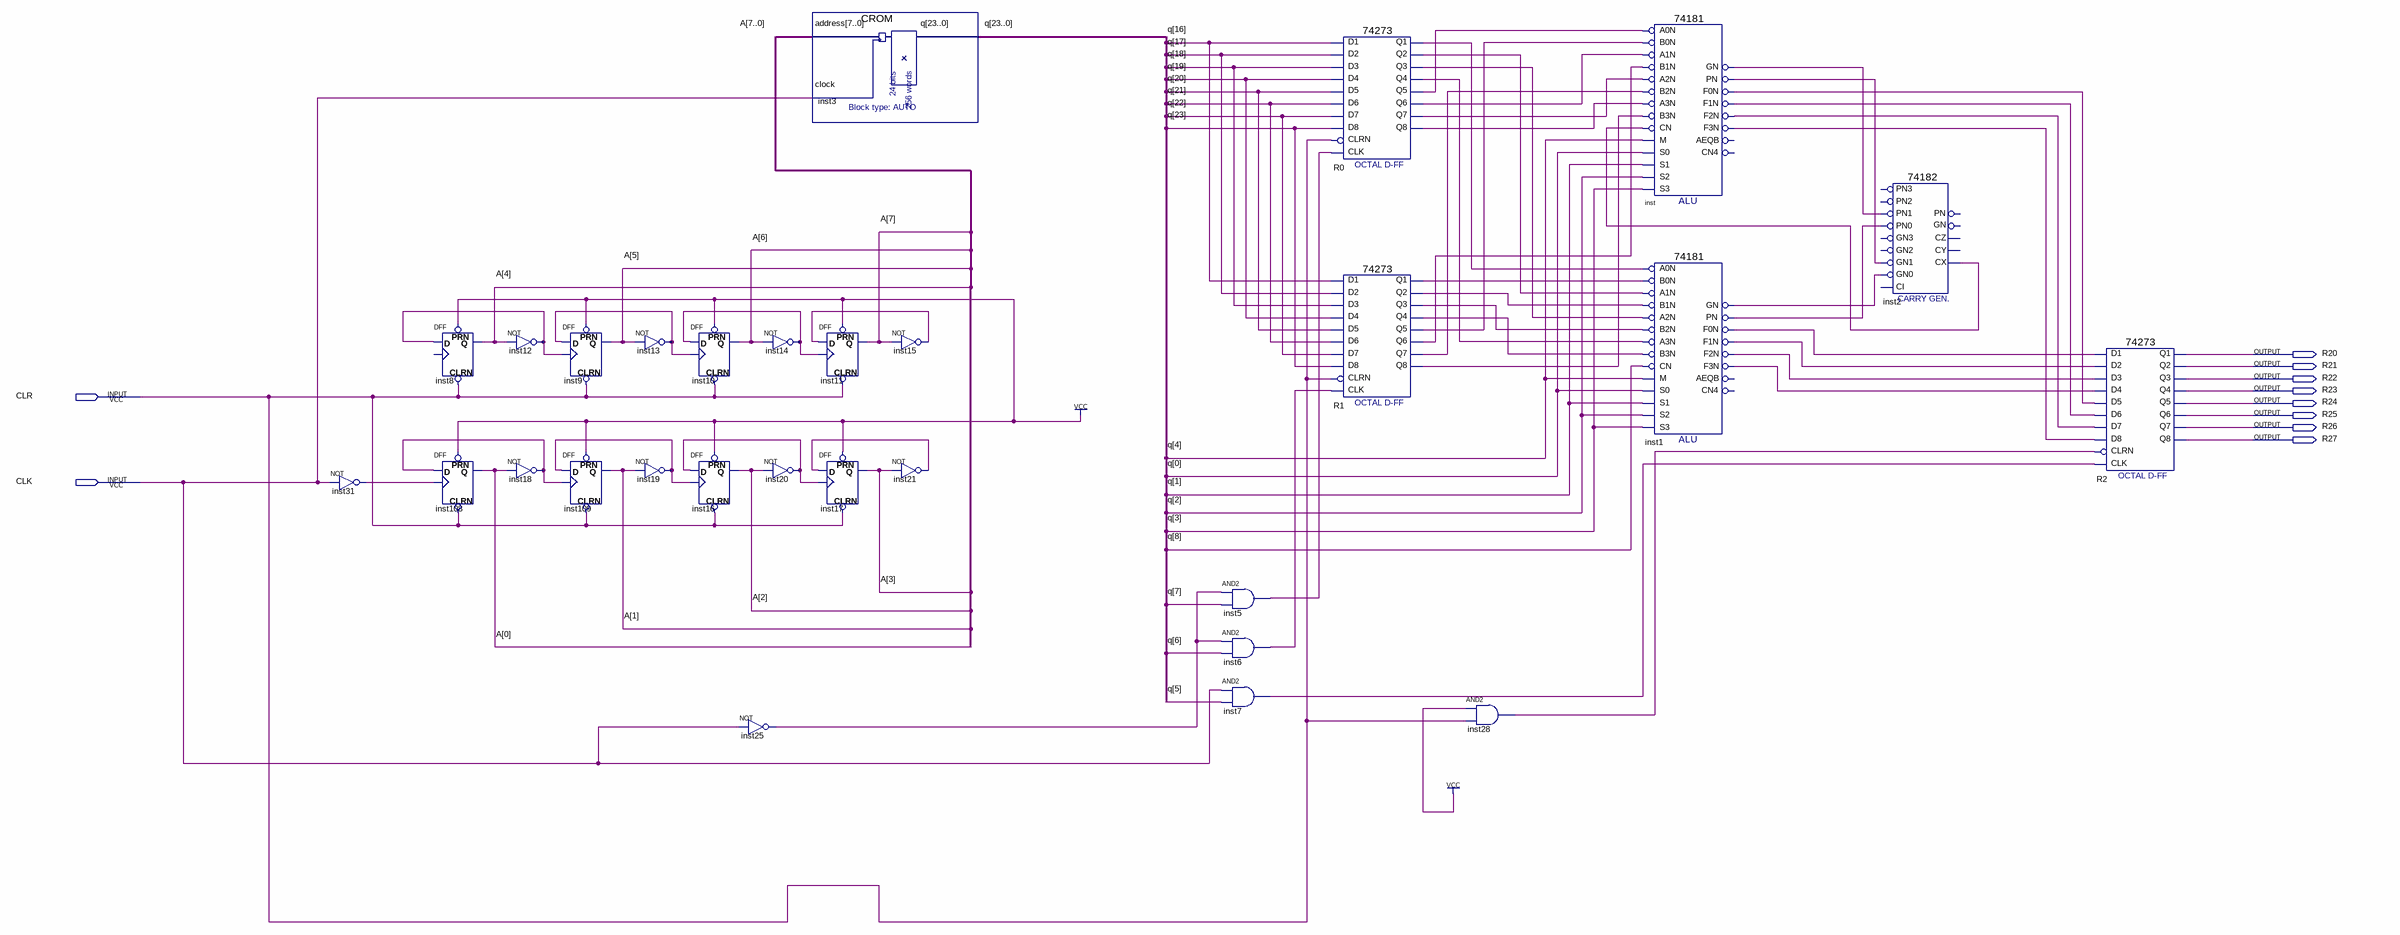
[diagram p0: schematic sheet]
// Quartus schematic exp1.bdf as structural Verilog: 29 symbols, 10 pins
module exp1 (
  input  CLR,
  input  CLK,
  output R20,
  output R21,
  output R22,
  output R23,
  output R24,
  output R25,
  output R26,
  output R27
);

  wire inst1_f0n, inst1_f1n, inst1_f2n, inst1_f3n, inst1_gn, inst1_pn, inst2_cx, inst5_out, inst6_out,
       inst7_out, inst12_out, inst13_out, inst14_out, inst15_out, inst18_out, inst19_out, inst20_out,
       inst21_out, inst25_out, inst28_out, inst31_out, inst_f0n, inst_f1n, inst_f2n, inst_f3n, inst_gn,
       inst_pn, R0_q1, R0_q2, R0_q3, R0_q4, R0_q5, R0_q6, R0_q7, R0_q8, R1_q1, R1_q2, R1_q3, R1_q4, R1_q5,
       R1_q6, R1_q7, R1_q8;
  wire [7:0] A;
  wire [23:0] q;

  not inst31 (inst31_out, CLK);
  DFF inst8 (.CLRN(CLR), .D(inst12_out), .PRN(1'b1), .Q(A[4]));  // open: CLK
  DFF inst108 (.CLRN(CLR), .CLK(inst31_out), .D(inst18_out), .PRN(1'b1), .Q(A[0]));
  not inst12 (inst12_out, A[4]);
  not inst18 (inst18_out, A[0]);
  DFF inst9 (.CLRN(CLR), .CLK(inst12_out), .D(inst13_out), .PRN(1'b1), .Q(A[5]));
  DFF inst109 (.CLRN(CLR), .CLK(inst18_out), .D(inst19_out), .PRN(1'b1), .Q(A[1]));
  not inst13 (inst13_out, A[5]);
  not inst19 (inst19_out, A[1]);
  DFF inst10 (.CLRN(CLR), .CLK(inst13_out), .D(inst14_out), .PRN(1'b1), .Q(A[6]));
  DFF inst16 (.CLRN(CLR), .CLK(inst19_out), .D(inst20_out), .PRN(1'b1), .Q(A[2]));
  not inst25 (inst25_out, CLK);
  not inst14 (inst14_out, A[6]);
  not inst20 (inst20_out, A[2]);
  CROM inst3 (.address(A), .clock(CLK), .q(q));
  DFF inst11 (.CLRN(CLR), .CLK(inst14_out), .D(inst15_out), .PRN(1'b1), .Q(A[7]));
  DFF inst17 (.CLRN(CLR), .CLK(inst20_out), .D(inst21_out), .PRN(1'b1), .Q(A[3]));
  not inst15 (inst15_out, A[7]);
  not inst21 (inst21_out, A[3]);
  and inst5 (inst5_out, inst25_out, q[7]);
  and inst6 (inst6_out, inst25_out, q[6]);
  and inst7 (inst7_out, CLK, q[5]);
  \74273  R0 (
    .D2(q[17]), .D3(q[18]), .D1(q[16]), .D4(q[19]), .D7(q[22]), .D6(q[21]), .D5(q[20]), .D8(q[23]),
    .CLK(inst5_out), .CLRN(CLR), .Q4(R0_q4), .Q1(R0_q1), .Q2(R0_q2), .Q3(R0_q3), .Q6(R0_q6), .Q5(R0_q5),
    .Q7(R0_q7), .Q8(R0_q8));
  \74273  R1 (
    .D2(q[17]), .D3(q[18]), .D1(q[16]), .D4(q[19]), .D7(q[22]), .D6(q[21]), .D5(q[20]), .D8(q[23]),
    .CLK(inst6_out), .CLRN(CLR), .Q4(R1_q4), .Q1(R1_q1), .Q2(R1_q2), .Q3(R1_q3), .Q6(R1_q6), .Q5(R1_q5),
    .Q7(R1_q7), .Q8(R1_q8));
  and inst28 (inst28_out, 1'b1, CLR);
  \74181  inst (
    .B0N(R1_q5), .A0N(R0_q5), .A1N(R0_q6), .B1N(R1_q6), .A3N(R0_q8), .B2N(R1_q7), .A2N(R0_q7), .M(q[4]),
    .CN(inst2_cx), .B3N(R1_q8), .S2(q[2]), .S1(q[1]), .S0(q[0]), .S3(q[3]), .PN(inst_pn), .GN(inst_gn),
    .F3N(inst_f3n), .F1N(inst_f1n), .F0N(inst_f0n), .F2N(inst_f2n));  // open: AEQB, CN4
  \74181  inst1 (
    .B0N(R1_q1), .A0N(R0_q1), .A1N(R0_q2), .B1N(R1_q2), .A3N(R0_q4), .B2N(R1_q3), .A2N(R0_q3), .M(q[4]),
    .CN(q[8]), .B3N(R1_q4), .S2(q[2]), .S1(q[1]), .S0(q[0]), .S3(q[3]), .PN(inst1_pn), .GN(inst1_gn),
    .F3N(inst1_f3n), .F1N(inst1_f1n), .F0N(inst1_f0n), .F2N(inst1_f2n));  // open: AEQB, CN4
  \74182  inst2 (
    .PN1(inst_gn), .PN0(inst1_pn), .GN1(inst_pn), .GN0(inst1_gn), .CX(inst2_cx));  // open: PN2, GN2, GN3, PN3, CI, CY, PN, CZ, GN
  \74273  R2 (
    .D2(inst1_f1n), .D3(inst1_f2n), .D1(inst1_f0n), .D4(inst1_f3n), .D7(inst_f2n), .D6(inst_f1n),
    .D5(inst_f0n), .D8(inst_f3n), .CLK(inst7_out), .CLRN(inst28_out), .Q4(R23), .Q1(R20), .Q2(R21), .Q3(R22),
    .Q6(R25), .Q5(R24), .Q7(R26), .Q8(R27));
endmodule
